# EAGLE design BB schematic (EAGLE 9.0.0)
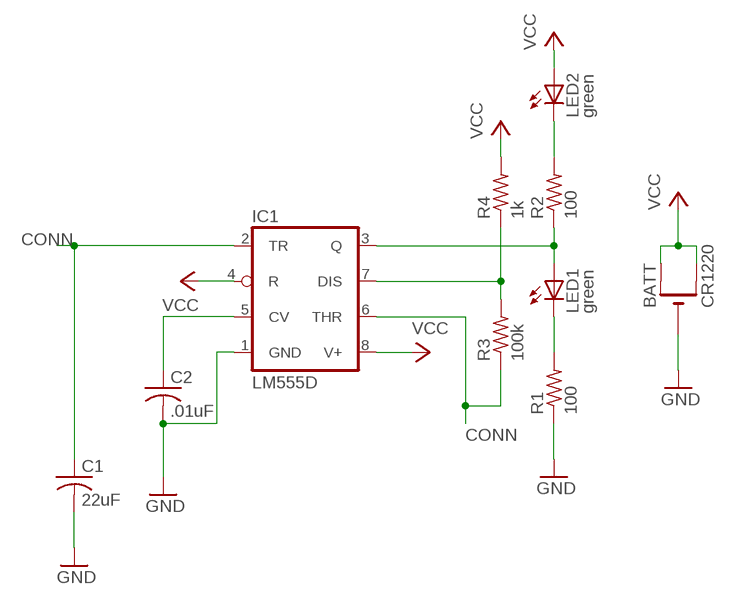
[diagram p0: schematic, sheet 1]

## Parts
BATT  CR1220  CR1220SMT  [CR1220-SMD]
C1  22uF  C-USC0805  [C0805]
C2  .01uF  C-USC0805  [C0805]
IC1  LM555D  [SO08]
LED1  green  LEDCHIPLED_0805  [CHIPLED_0805]
LED2  green  LEDCHIPLED_0805  [CHIPLED_0805]
R1  100  R-US_R0805  [R0805]
R2  100  R-US_R0805  [R0805]
R3  100k  R-US_R0805  [R0805]
R4  1k  R-US_R0805  [R0805]

## Nets
CONN: C1.1 IC1.2(TR) IC1.6(THR) R3.1
GND: BATT.- C1.2 C2.2 IC1.1(GND) R1.1
N$1: LED2.C R2.2
N$2: IC1.3(Q) LED1.A R2.1
N$3: LED1.C R1.2
N$4: IC1.7(DIS) R3.2 R4.1
N$5: C2.1 IC1.5(CV)
VCC: BATT.+$1(+) BATT.+$2(+1) IC1.4(R) IC1.8(V+) LED2.A R4.2

## Library data of the parts
BATT = adafruit:CR1220: CR1216/CR1220/CR1225 12mm 3V lithium coin cell Great for battery packup. Both SMT and THM holders. Note the THM package has the ground pads on both sides of the PCB so that the masks are the same - this reduces the cost; MPN: 3080; OC_NEWARK: 25T0433
C1 = adafruit:C-US: CAPACITOR, American symbol; MPN: C2012X5R0J226M125AC; OC_NEWARK: 48T2918
C2 = adafruit:C-US: CAPACITOR, American symbol; MPN: MC0805B103M500CT; OC_NEWARK: 06R3737
IC1 = adafruit:*555: TIMER Changed DIP package to have round (not oval) pin pads http://www.ladyada.net/library/pcb/eaglelibrary.html; MF: TEXAS INSTRUMENTS; MPN: TLC555ID; OC_NEWARK: 08F9144
LED1 LED2 = adafruit:LED: LED OSRAM: - CHIPLED LG R971, LG N971, LY N971, LG Q971, LY Q971, LO R971, LY R971 LH N974, LH R974 LS Q976, LO Q976, LY Q976 LO Q996 - Hyper CHIPLED LW Q18S LB Q993, LB Q99A, LB R99A - SideLED LS A670, LO A670, LY A670, LG A670, LP A670 LB A673, LV A673, LT A673, LW A673 LH A674 LY A675 LS A676, LA A676, LO A676, LY A676, LW A676 LS A679, LY A679, LG A679 - Hyper Micro SIDELED® LS Y876, LA Y876, LO Y876, LY Y876 LT Y87S - SmartLED LW L88C, LW L88S LB L89C, LB L89S, LG L890 LS L89K, LO L89K, LY L89K LS L896, LA L896, LO L896, LY L896 - TOPLED LS T670, LO T670, LY T670, LG T670, LP T670 LSG T670, LSP T670, LSY T670, LOP T670, LYG T670 LG T671, LOG T671, LSG T671 LB T673, LV T673, LT T673, LW T673 LH T674 LS T676, LA T676, LO T676, LY T676, LB T676, LH T676, LSB T676, LW T676 LB T67C, LV T67C, LT T67C, LS T67K, LO T67K, LY T67K, LW E67C LS E67B, LA E67B, LO E67B, LY E67B, LB E67C, LV E67C, LT E67C LW T67C LS T679, LY T679, LG T679 LS T770, LO T770, LY T770, LG T770, LP T770 LB T773, LV T773, LT T773, LW T773 LH T774 LS E675, LA E675, LY E675, LS T675 LS T776, LA T776, LO T776, LY T776, LB T776 LHGB T686 LT T68C, LB T68C - Hyper Mini TOPLED® LB M676 - Mini TOPLED Santana® LG M470 LS M47K, LO M47K, LY M47K Source: http://www.osram.convergy.de/; MPN: 5988170107F; OC_NEWARK: 75R0587
R1 R2 = adafruit:R-US_: RESISTOR, American symbol; MPN: MCTF0805BTC1000; OC_NEWARK: 01P2077
R3 = adafruit:R-US_: RESISTOR, American symbol; MF: VISHAY/DALE; MPN: CRCW0805100KFKTA; OC_NEWARK: 05F1513
R4 = adafruit:R-US_: RESISTOR, American symbol; MPN: MCTF0805BTC1001; OC_NEWARK: 01P2079

## Net classes
0 default: width 0.305 mm, drill 0.508 mm, clearance 0.254 mm

## Board
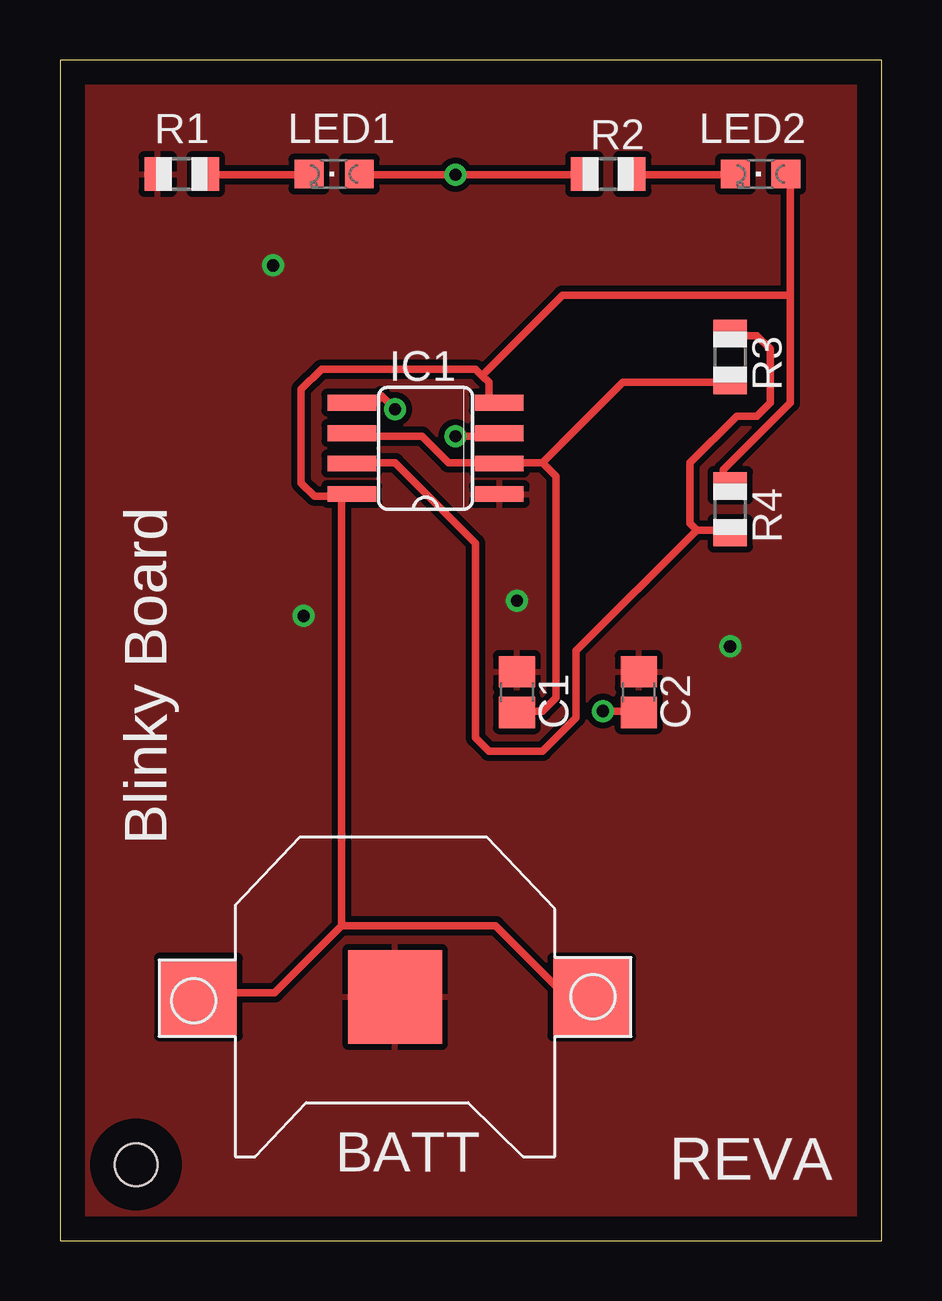
[diagram p1: board, top side]
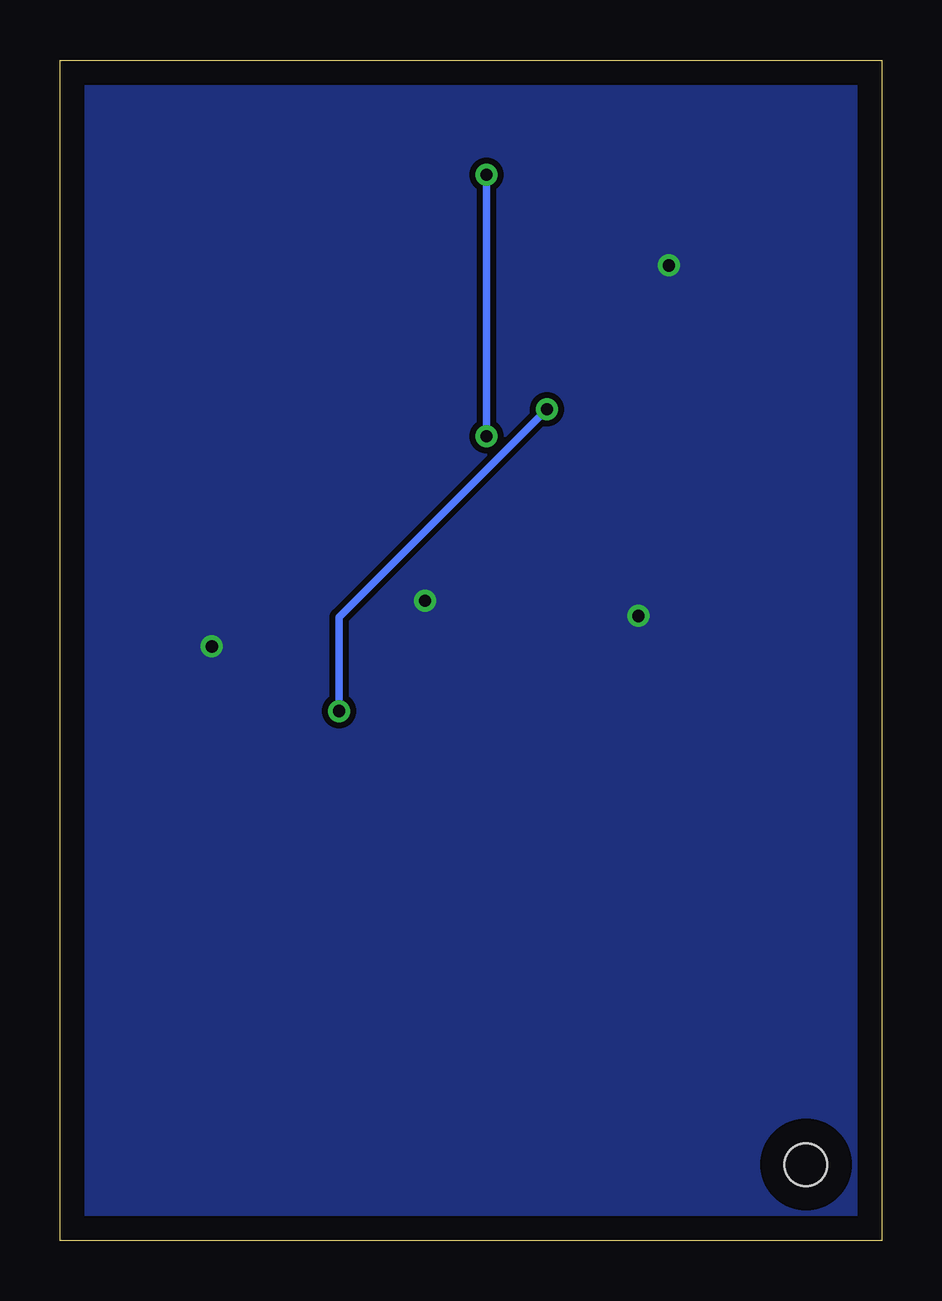
[diagram p2: board, bottom side, seen from below]

Size 34.27 x 49.2 mm. Coordinates in mm from the lower left corner, seen from the top.
Outline: 0,0 34.27,0 34.27,49.2 0,49.2 0,0
Copper layers (1*16): Top 0.035mm / dielectric 1.5mm / Bottom 0.035mm
Design rules "default": minimum track width 6mil, minimum drill 0.35mm, track to track 6mil, track to pad 6mil, pad to pad 6mil, via to via 6mil, smd to smd 6mil, copper to edge 40mil, drill to drill 6mil, minimum pad ring 10mil, minimum via ring 8mil, stop-mask expansion 4mil, vias tented up to drill 0mil, thermal gap 10mil
Holes 1.78 mm at 3.17,3.17

### Footprints (pad centres in the part's own frame; a part is rotated, then mirrored left to right if it is on the bottom)
CR1220-SMD = smd 3.2 x 3.2: +$1 -8.2,0; +$2 8.2,0 | smd 3.9 x 3.9: - 0,0
C0805 = smd 1.3 x 1.5: 1 -0.85,0; 2 0.85,0
SO08 = smd 0.66 x 2.032: 1 -1.905,-3.073; 2 -0.635,-3.073; 3 0.635,-3.073; 4 1.905,-3.073; 5 1.905,3.073; 6 0.635,3.073; 7 -0.635,3.073; 8 -1.905,3.073
CHIPLED_0805 = smd 1.2 x 1.2: A 0,-1.05; C 0,1.05
R0805 = smd 1.1 x 1.4: 1 -1,0; 2 1,0

### Placement (x,y rotation side)
BATT  13.97,10.16 180 top
C1  19.05,22.86 90 top
C2  24.13,22.86 90 top
IC1  15.24,33.02 90 top
LED1  11.43,44.45 90 top
LED2  29.21,44.45 90 top
R1  5.08,44.45 0 top
R2  22.86,44.45 0 top
R3  27.94,36.83 90 top
R4  27.94,30.48 90 top

### Tracks (layer width: path | path; a pad name or v marks a point on that pad's centre or on a via)
CONN
  Top 0.305: 20.12,32.41 23.47,35.76 27.94,35.76 R3.1 | 20.12,32.41 18.44,32.41 IC1.2 18.16,32.41 16.2,32.41 15.09,33.53 12.29,33.53 IC1.6 | 20.12,32.41 20.68,31.85 20.68,22.63 20.12,22.07 19.28,22.07 C1.1
GND  (via drill 0.51)
  other vias: 27.94,24.77 19.05,26.67 10.16,26.04 8.89,40.64
  pour Top: -1.27,50.8 35.56,50.8 35.56,-1.27 -1.27,-1.27
  pour Bottom: -1.27,49.53 -1.27,-0.64 -0.64,-1.27 35.56,-1.27 36.2,-0.64 36.2,49.53
N$1
  Top 0.305: LED2.C 27.94,44.42 24.03,44.42 R2.2
N$2  (via drill 0.51)
  Top 0.305: LED1.A 12.57,44.42 v16.48,44.42 21.79,44.42 R2.1 | v16.48,33.53 18.16,33.53 IC1.3
  Bottom 0.305: v16.48,44.42 v16.48,33.53
N$3
  Top 0.305: LED1.C 10.34,44.42 6.15,44.42 R1.2
N$4
  Top 0.305: 26.54,29.62 27.94,29.62 R4.1 | 26.54,29.62 26.26,29.9 26.26,32.41 28.22,34.37 29.06,34.37 29.62,34.92 29.62,37.16 29.06,37.72 27.94,37.72 R3.2 | 26.54,29.62 21.51,24.59 21.51,21.79 20.12,20.4 17.88,20.4 17.32,20.95 17.32,29.06 13.97,32.41 12.29,32.41 IC1.7
N$5  (via drill 0.51)
  Top 0.305: v22.63,22.07 24.03,22.07 C2.1 | v13.97,34.65 13.41,35.2 13.13,34.92 IC1.5
  Bottom 0.305: v22.63,22.07 22.63,25.98 v13.97,34.65
VCC
  Top 0.305: 11.73,13.13 8.94,10.34 5.87,10.34 BATT.+$2 | 11.73,13.13 18.16,13.13 20.95,10.34 22.07,10.34 BATT.+$1 | 11.73,31.01 10.62,31.01 10.06,31.57 10.06,35.48 10.9,36.32 17.32,36.32 17.6,36.04 | 11.73,31.01 12.01,31.01 IC1.8 11.73,31.01 | 17.6,36.04 17.88,35.76 17.88,34.92 IC1.4 | 30.45,39.4 30.45,34.92 27.66,32.13 27.66,31.85 27.94,31.57 R4.2 | 30.45,39.4 30.45,44.42 LED2.A | 17.6,36.04 20.95,39.4 30.45,39.4 | 11.73,31.01 11.73,13.13

### Text on the board
tPlace: Blinky Board | REVA